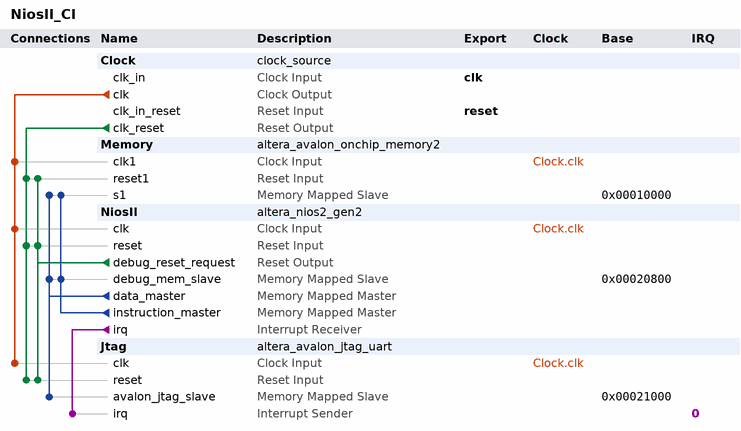
[diagram p0: system contents]
# Platform Designer (Qsys) system NiosII_CI, Cyclone V 5CSEMA5F31C6
# Parameters at their usual value, and those the tool derives, are not listed.
package require -exact qsys 18.1
create_system NiosII_CI
set_project_property DEVICE_FAMILY {Cyclone V}
set_project_property DEVICE 5CSEMA5F31C6

add_instance Clock clock_source 18.1
set_instance_parameter_value Clock clockFrequency 50000000

add_instance Memory altera_avalon_onchip_memory2 18.1
set_instance_parameter_value Memory dataWidth 32
set_instance_parameter_value Memory dualPort false
set_instance_parameter_value Memory initMemContent true
set_instance_parameter_value Memory initializationFileName onchip_mem.hex
set_instance_parameter_value Memory memorySize 40096

add_instance NiosII altera_nios2_gen2 18.1
set_instance_parameter_value NiosII dcache_size 2048
set_instance_parameter_value NiosII exceptionSlave Memory.s1
set_instance_parameter_value NiosII icache_size 4096
set_instance_parameter_value NiosII impl Fast
set_instance_parameter_value NiosII resetSlave Memory.s1

add_instance Jtag altera_avalon_jtag_uart 18.1
set_instance_parameter_value Jtag simInteractiveOptions NO_INTERACTIVE_WINDOWS

# connections
add_connection Clock.clk Jtag.clk clock
add_connection Clock.clk Memory.clk1 clock
add_connection Clock.clk NiosII.clk clock
add_connection Clock.clk_reset Jtag.reset reset
add_connection Clock.clk_reset Memory.reset1 reset
add_connection Clock.clk_reset NiosII.reset reset
add_connection NiosII.debug_reset_request Jtag.reset reset
add_connection NiosII.debug_reset_request Memory.reset1 reset
add_connection NiosII.debug_reset_request NiosII.reset reset
add_connection NiosII.data_master Jtag.avalon_jtag_slave avalon
set_connection_parameter_value NiosII.data_master/Jtag.avalon_jtag_slave baseAddress 0x00021000
add_connection NiosII.data_master Memory.s1 avalon
set_connection_parameter_value NiosII.data_master/Memory.s1 baseAddress 0x00010000
add_connection NiosII.data_master NiosII.debug_mem_slave avalon
set_connection_parameter_value NiosII.data_master/NiosII.debug_mem_slave baseAddress 0x00020800
add_connection NiosII.instruction_master Memory.s1 avalon
set_connection_parameter_value NiosII.instruction_master/Memory.s1 baseAddress 0x00010000
add_connection NiosII.instruction_master NiosII.debug_mem_slave avalon
set_connection_parameter_value NiosII.instruction_master/NiosII.debug_mem_slave baseAddress 0x00020800
add_connection NiosII.irq Jtag.irq interrupt
set_connection_parameter_value NiosII.irq/Jtag.irq irqNumber 0

# exported interfaces
add_interface clk clock sink
set_interface_property clk EXPORT_OF Clock.clk_in
add_interface reset reset sink
set_interface_property reset EXPORT_OF Clock.clk_in_reset

set_interconnect_requirement {$system} qsys_mm.clockCrossingAdapter HANDSHAKE
set_interconnect_requirement {$system} qsys_mm.enableEccProtection FALSE
set_interconnect_requirement {$system} qsys_mm.insertDefaultSlave FALSE
set_interconnect_requirement {$system} qsys_mm.maxAdditionalLatency 1

save_system NiosII_CI.qsys
